# Altium project 装甲板（行程开关方案）.PrjPcb
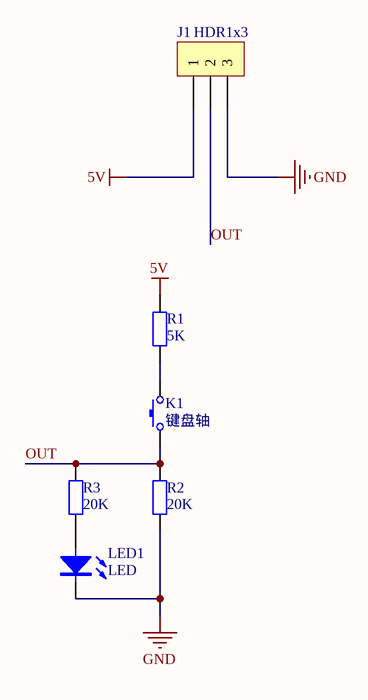
[diagram p0: 装甲板（行程开关方案）.SchDoc]
1 sheet, 6 parts. Net scope: global (net labels, ports and power ports of the same name join across sheets).
Board file: 装甲板（行程开关方案）.PcbDoc

## Sheet 装甲板（行程开关方案）.SchDoc
size A4; SheetNumber: 1; SheetTotal: 1

### Parts
J1  HDR1x3  [排针排母 3P 2.54mm]
K1  键盘轴  [键盘轴（单端固定）]
LED1  LED  [LED_0603]
R1  5K  [0603_R]
R2  20K  [0603_R]
R3  20K  [0603_R]

### Nets
5V: J1.1 R1.2
GND: J1.3 LED1.2(C) R2.1
OUT: J1.2 K1.1 R2.2 R3.2
NetK1_2: K1.2 R1.1
NetLED1_1: LED1.1(A) R3.1

### Library data of the parts
J1 = HDR1x3: Connector
K1 = 键盘轴: Key
R1-R3 = RES: Resistor